# EAGLE schematic DEBOUNCING (EAGLE 7.4.0)
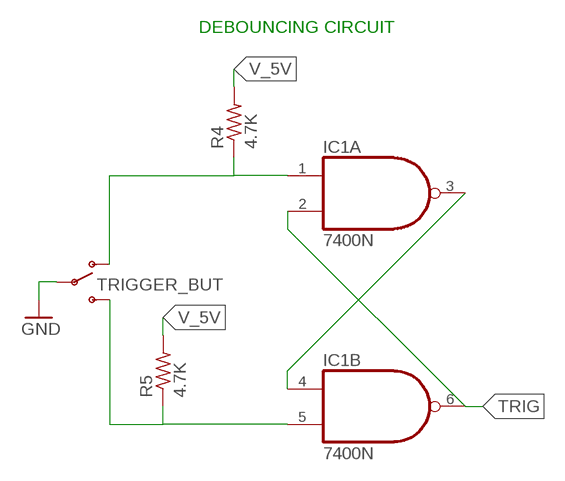
[diagram p0: schematic, sheet 1]

## Parts
IC1  7400N  [DIL14]
R4  4.7K  R-US_0207/2V  [0207/2V]
R5  4.7K  R-US_0207/2V  [0207/2V]
TRIGGER_BUT  SWITCH-SPDTPTH  [SWITCH-SPDT]

## Nets
GND: TRIGGER_BUT.2(P)
N$2: IC1.5(B:I1) R5.1 TRIGGER_BUT.3(S)
N$3: IC1.1(A:I0) R4.1 TRIGGER_BUT.1(O)
N$9: IC1.3(A:O) IC1.4(B:I0)
TRIG: IC1.2(A:I1) IC1.6(B:O)
V_5V: R4.2 R5.2
Unconnected: IC1.8(C:O) IC1.9(C:I0) IC1.10(C:I1) IC1.11(D:O) IC1.12(D:I0) IC1.13(D:I1)

## Notes on the sheet
- DEBOUNCING CIRCUIT

## Power pins joined to a net without a drawn wire
GND: IC1.7(P:GND)
VCC: IC1.14(P:VCC)

## Library data of the parts
IC1 = 74xx-us:74*00: Quad 2-input NAND gate
R4 R5 = adafruit:R-US_: RESISTOR, American symbol
TRIGGER_BUT = SparkFun-Electromechanical:SWITCH-SPDT: SPDT Switch Simple slide switch, Spark Fun Electronics SKU : COM-00102 DPDT SMT slide switch, AYZ0202, SWCH-08179; PROD_ID: SWCH-08261